# EAGLE schematic AZSMZ (EAGLE 7.2.0)
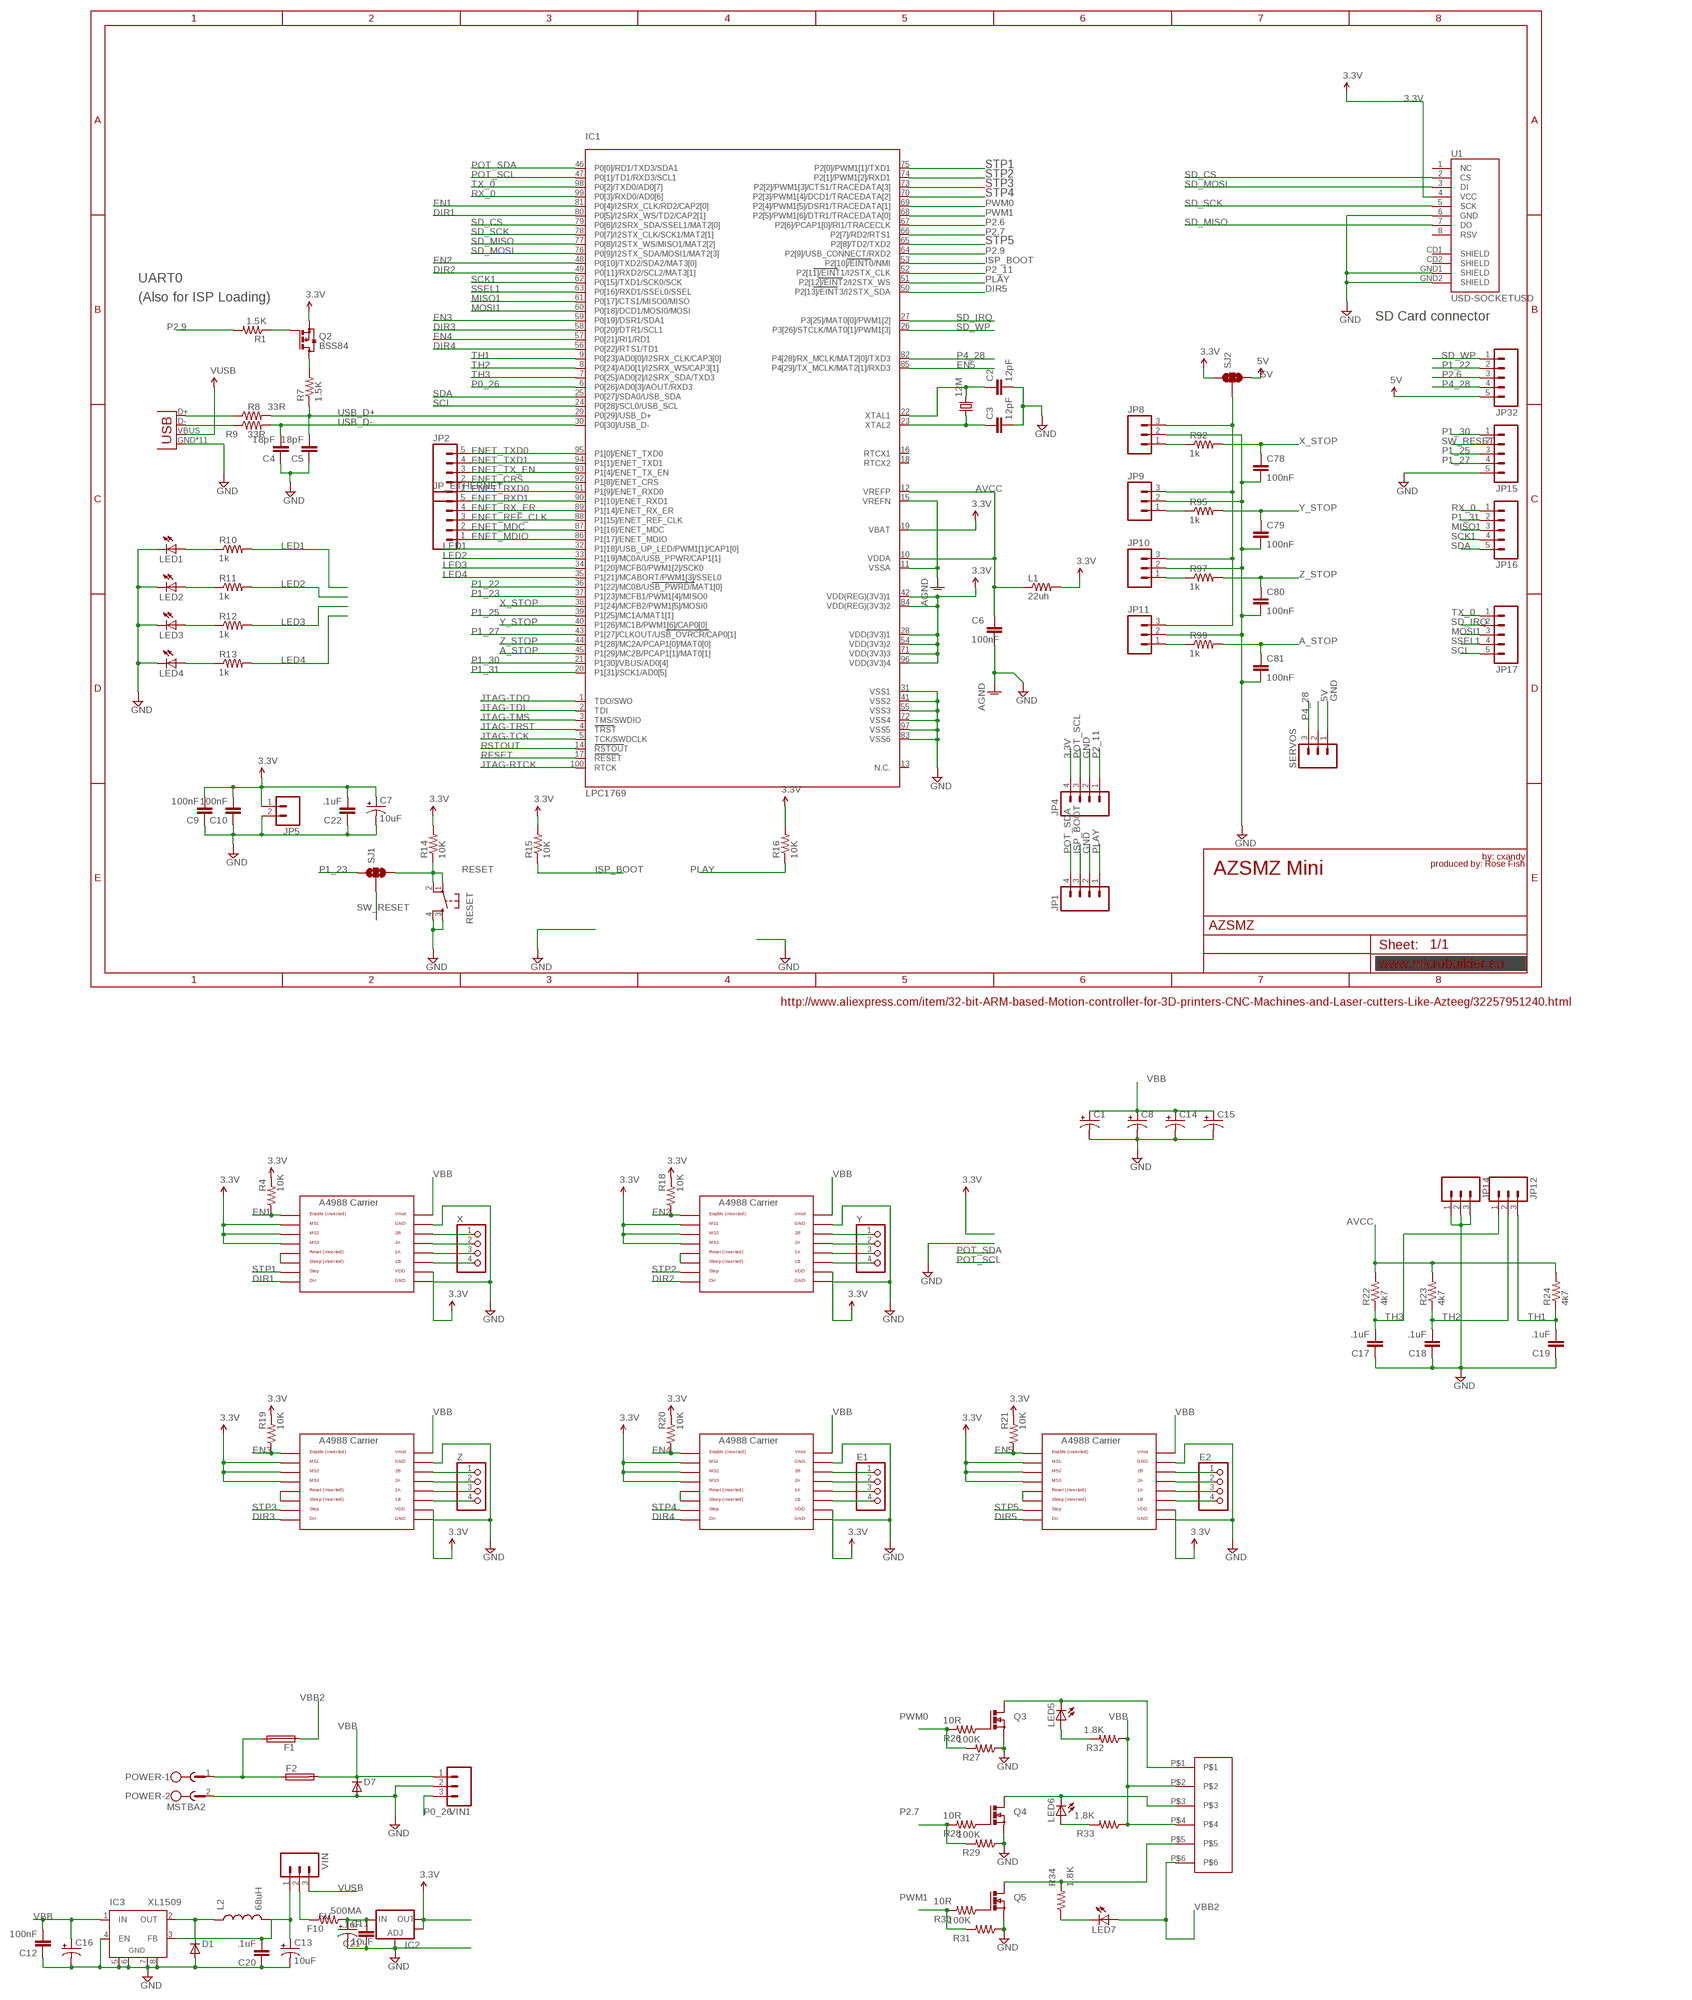
[diagram p0: schematic, sheet 1]

## Parts
12M  CRYSTALHC49S  [HC49/S]
C1  CPOL-US153CLV-0605  [153CLV-0605]
C2  12pF  C-EUC0805K  [C0805K]
C3  12pF  C-EUC0805K  [C0805K]
C4  18pF  C-EUC0805K  [C0805K]
C5  18pF  C-EUC0805  [C0805]
C6  100nF  C-EUC0805K  [C0805K]
C7  10uF  CAP_POL1206  [EIA3216]
C8  CPOL-US153CLV-0605  [153CLV-0605]
C9  100nF  C-EUC0805K  [C0805K]
C10  100nF  C-EUC0805  [C0805]
C11  10uF  CAP_POL1206  [EIA3216]
C12  100nF  C-EUC0805  [C0805]
C13  10uF  CAP_POL1206  [EIA3216]
C14  CPOL-US153CLV-0605  [153CLV-0605]
C15  CPOL-US153CLV-0605  [153CLV-0605]
C16  CPOL-US153CLV-0605  [153CLV-0605]
C17  .1uF  C-EUC0805K  [C0805K]
C18  .1uF  C-EUC0805K  [C0805K]
C19  .1uF  C-EUC0805K  [C0805K]
C20  .1uF  C-EUC0805K  [C0805K]
C21  .1uF  C-EUC0805K  [C0805K]
C22  .1uF  C-EUC0805K  [C0805K]
C78  100nF  C-EUC0805K  [C0805K]
C79  100nF  C-EUC0805K  [C0805K]
C80  100nF  C-EUC0805K  [C0805K]
C81  100nF  C-EUC0805K  [C0805K]
D1  IN4004  CGRM4004-G  [SOD-123_MINI-SMA]
D7  IN4004  CGRM4004-G  [SOD-123_MINI-SMA]
E1  PINHD-1X4  [1X04]
E2  PINHD-1X4  [1X04]
F1  REPRAPJR_PTCFUSE  [REPRAPJR_MFR500]
F2  REPRAPJR_PTCFUSE  [REPRAPJR_MFR500]
F10  500MA  R-US_R1206  [R1206]
IC1  LPC1769  LPC1768  [LQFP100]
IC2  V_REG_LM1117SOT223  [SOT223]
IC3  XL1509  [SO08]
JP1  M04PTHS  [1X04C]
JP2  M051.27MM  [1X05-1.27MM]
JP4  M04PTH  [1X04]
JP5  M021X02-1.27  [1X02-1.27MM]
JP8  M03PTH  [1X03]
JP9  M03PTH  [1X03]
JP10  M03PTH  [1X03]
JP11  M03PTH  [1X03]
JP12  M03PTH  [1X03]
JP14  M03PTH  [1X03]
JP15  M05PTH  [1X05]
JP16  M05PTH  [1X05]
JP17  M05PTH  [1X05]
JP32  M05PTH  [1X05]
JP_ETHERNET  M051.27MM  [1X05-1.27MM]
L1  22uh  R-US_M1206  [M1206]
L2  68uH  INDUCTORCR54  [CR54]
LED1  LEDCHIP-LED0805  [CHIP-LED0805]
LED2  LEDCHIP-LED0805  [CHIP-LED0805]
LED3  LEDCHIP-LED0805  [CHIP-LED0805]
LED4  LEDCHIP-LED0805  [CHIP-LED0805]
LED5  LEDCHIP-LED0805  [CHIP-LED0805]
LED6  LEDCHIP-LED0805  [CHIP-LED0805]
LED7  LEDCHIP-LED0805  [CHIP-LED0805]
POWER  MSTBA2  [MSTBA2]
Q2  BSS84  [SOT23]
Q3  IRF512TO220  [TO220BVS]
Q4  IRF512  [TO220BV]
Q5  IRF512TO220  [TO220BVS]
R1  1.5K  R-US_M0805  [M0805]
R4  10K  R-US_M0805  [M0805]
R7  1.5K  R-US_M0805  [M0805]
R8  33R  R-US_M0805  [M0805]
R9  33R  R-US_M0805  [M0805]
R10  1k  R-US_M0805  [M0805]
R11  1k  R-US_M0805  [M0805]
R12  1k  R-US_M0805  [M0805]
R13  1k  R-US_M0805  [M0805]
R14  10K  R-US_M0805  [M0805]
R15  10K  R-US_M0805  [M0805]
R16  10K  R-US_M0805  [M0805]
R18  10K  R-US_M0805  [M0805]
R19  10K  R-US_M0805  [M0805]
R20  10K  R-US_M0805  [M0805]
R21  10K  R-US_M0805  [M0805]
R22  4k7  R-US_M0805  [M0805]
R23  4k7  R-US_M0805  [M0805]
R24  4k7  R-US_M0805  [M0805]
R26  10R  R-US_M0805  [M0805]
R27  100K  R-US_M0805  [M0805]
R28  10R  R-US_M0805  [M0805]
R29  100K  R-US_M0805  [M0805]
R30  10R  R-US_M0805  [M0805]
R31  100K  R-US_M0805  [M0805]
R32  1.8K  R-US_M0805  [M0805]
R33  1.8K  R-US_M0805  [M0805]
R34  1.8K  R-US_M0805  [M0805]
R92  1k  R-US_M0805  [M0805]
R95  1k  R-US_M0805  [M0805]
R97  1k  R-US_M0805  [M0805]
R99  1k  R-US_M0805  [M0805]
RESET  TAC_SWITCHSMD  [TACTILE_SWITCH_SMD]
SERVOS  M03PTH  [1X03]
SJ1  SOLDERJUMPER_2WAYS  [SJ_3]
SJ2  SOLDERJUMPER_2WAYS  [SJ_3]
U1  USD-SOCKETUSD  [USD-SOCKET-PP]
U$3  282837-6  [282837-6]
U$11  A4988BREAKOUT  [A4988BREAKOUT]
U$12  A4988BREAKOUT  [A4988BREAKOUT]
U$13  A4988BREAKOUT  [A4988BREAKOUT]
U$14  A4988BREAKOUT  [A4988BREAKOUT]
U$15  A4988BREAKOUT  [A4988BREAKOUT]
VIN  M03PTH  [1X03]
VIN1  M03PTH  [1X03]
X  PINHD-1X4  [1X04]
X1  USB-MICROB  [USB-MICROB]
Y  PINHD-1X4  [1X04]
Z  PINHD-1X4  [1X04]

## Nets
3.3V: C7.A(+) C9.2 C10.2 C22.2 IC1.19(VBAT) IC1.28(VDD(3V3)1) IC1.42(VDD(REG)(3V3)1) IC1.54(VDD(3V3)2) IC1.71(VDD(3V3)3) IC1.84(VDD(REG)(3V3)2) IC1.96(VDD(3V3)4) IC2.2(OUT) IC2.4(OUT) JP4.4 JP5.1 L1.2 Q2.2(S) R4.2 R14.2 R15.2 R16.2 R18.2 R19.2 R20.2 R21.2 SJ2.1 U1.4(VCC) U$11.MS1 U$11.MS2 U$11.MS3 U$11.VDD U$12.MS1 U$12.MS2 U$12.MS3 U$12.VDD U$13.MS1 U$13.MS2 U$13.MS3 U$13.VDD U$14.MS1 U$14.MS2 U$14.MS3 U$14.VDD U$15.MS1 U$15.MS2 U$15.MS3 U$15.VDD
5V: C11.A(+) C21.2 F10.1 IC2.3(IN) JP32.5 SERVOS.2 SJ2.3
A_STOP: C81.1 IC1.45(P1[29]/MC2B/PCAP1[1]/MAT0[1]) R99.2
AGND: C6.2 IC1.11(VSSA) IC1.15(VREFN) ; supply symbol labelled GND
AVCC: C6.1 IC1.10(VDDA) IC1.12(VREFP) L1.1 R22.2 R23.2 R24.2
DIR1: IC1.80(P0[5]/I2SRX_WS/TD2/CAP2[1]) U$11.DIR
DIR2: IC1.49(P0[11]/RXD2/SCL2/MAT3[1]) U$12.DIR
DIR3: IC1.58(P0[20]/DTR1/SCL1) U$13.DIR
DIR4: IC1.56(P0[22]/RTS1/TD1) U$14.DIR
DIR5: IC1.50(P2[13]/EINT3/I2STX_SDA) U$15.DIR
EN1: IC1.81(P0[4]/I2SRX_CLK/RD2/CAP2[0]) R4.1 U$11.EN
EN2: IC1.48(P0[10]/TXD2/SDA2/MAT3[0]) R18.1 U$12.EN
EN3: IC1.59(P0[19]/DSR1/SDA1) R19.1 U$13.EN
EN4: IC1.57(P0[21]/RI1/RD1) R20.1 U$14.EN
EN5: IC1.85(P4[29]/TX_MCLK/MAT2[1]/RXD3) R21.1 U$15.EN
ENET_CRS: IC1.92(P1[8]/ENET_CRS) JP2.2
ENET_MDC: IC1.87(P1[16]/ENET_MDC) JP_ETHERNET.2
ENET_MDIO: IC1.86(P1[17]/ENET_MDIO) JP_ETHERNET.1
ENET_REF_CLK: IC1.88(P1[15]/ENET_REF_CLK) JP_ETHERNET.3
ENET_RX_ER: IC1.89(P1[14]/ENET_RX_ER) JP_ETHERNET.4
ENET_RXD0: IC1.91(P1[9]/ENET_RXD0) JP2.1
ENET_RXD1: IC1.90(P1[10]/ENET_RXD1) JP_ETHERNET.5
ENET_TX_EN: IC1.93(P1[4]/ENET_TX_EN) JP2.3
ENET_TXD0: IC1.95(P1[0]/ENET_TXD0) JP2.5
ENET_TXD1: IC1.94(P1[1]/ENET_TXD1) JP2.4
GND: C1.- C2.2 C3.2 C4.1 C5.1 C7.C(-) C8.- C9.1 C10.1 C11.C(-) C12.1 C13.C(-) C14.- C15.- C16.- C17.1 C18.1 C19.1 C20.1 C21.1 C22.1 C78.2 C79.2 C80.2 C81.2 D1.A D7.A IC1.31(VSS1) IC1.41(VSS2) IC1.55(VSS3) IC1.72(VSS4) IC1.83(VSS6) IC1.97(VSS5) IC2.1(ADJ) IC3.4(EN) IC3.5(GND) IC3.6(GND1) IC3.7(GND2) IC3.8(GND) JP1.2 JP4.2 JP5.2 JP8.2 JP9.2 JP10.2 JP11.2 JP14.1 JP14.2 JP14.3 JP15.5 LED1.C LED2.C LED3.C LED4.C POWER.2 Q3.S Q4.S Q5.S R27.1 R29.1 R31.1 RESET.3 RESET.4 SERVOS.1 U1.6(GND) U1.GND1(SHIELD) U1.GND2(SHIELD) U$11.GND U$11.GND@0(GND) U$12.GND U$12.GND@0(GND) U$13.GND U$13.GND@0(GND) U$14.GND U$14.GND@0(GND) U$15.GND U$15.GND@0(GND) VIN1.2 X1.GND X1.MT1(GND) X1.MT2(GND) X1.MT3(GND) X1.MT4(GND) X1.P$1(GND) X1.P$2(GND) X1.P$3(GND) X1.P$4(GND) X1.P$5(GND) X1.P$6(GND)
ISP_BOOT: IC1.53(P2[10]/EINT0/NMI) JP1.3 R15.1
JTAG-RTCK: IC1.100(RTCK)
JTAG-TCK: IC1.5(TCK/SWDCLK)
JTAG-TDI: IC1.2(TDI)
JTAG-TDO: IC1.1(TDO/SWO)
JTAG-TMS: IC1.3(TMS/SWDIO)
JTAG-TRST: IC1.4(TRST)
LED1: IC1.32(P1[18]/USB_UP_LED/PWM1[1]/CAP1[0]) R10.2
LED2: IC1.33(P1[19]/MC0A/USB_PPWR/CAP1[1]) R11.2
LED3: IC1.34(P1[20]/MCFB0/PWM1[2]/SCK0) R12.2
LED4: IC1.35(P1[21]/MCABORT/PWM1[3]/SSEL0) R13.2
MISO1: IC1.61(P0[17]/CTS1/MISO0/MISO) JP16.3
MOSI1: IC1.60(P0[18]/DCD1/MOSI0/MOSI) JP17.3
N$1: 12M.2 C2.1 IC1.22(XTAL1)
N$2: 12M.1 C3.1 IC1.23(XTAL2)
N$3: U$11.2B X.1
N$4: U$12.RST U$12.SLP(SLEEP)
N$5: Q2.1(G) R1.1
N$6: U$11.2A X.2
N$7: U$11.1A X.3
N$8: U$12.2B Y.1
N$9: U$11.RST U$11.SLP(SLEEP)
N$10: U$12.2A Y.2
N$11: U$12.1A Y.3
N$12: U$12.1B Y.4
N$13: U$11.1B X.4
N$14: U$13.RST U$13.SLP(SLEEP)
N$15: U$13.2B Z.1
N$16: Q5.D Q5.D1(D) R34.2 U$3.P$5
N$17: U$13.2A Z.2
N$18: LED7.C R34.1
N$19: F1.2 F2.1 F2.3 F2.4 POWER.1
N$20: U$13.1A Z.3
N$21: U$13.1B Z.4
N$22: U$14.RST U$14.SLP(SLEEP)
N$24: E1.1 U$14.2B
N$25: E1.2 U$14.2A
N$26: E1.3 U$14.1A
N$27: E1.4 U$14.1B
N$28: U$15.RST U$15.SLP(SLEEP)
N$29: E2.1 U$15.2B
N$30: E2.2 U$15.2A
N$31: E2.3 U$15.1A
N$32: E2.4 U$15.1B
N$35: Q3.G R26.1
N$36: Q4.G R28.1
N$37: Q5.G R30.1
N$40: F10.2 VIN.2
N$41: D1.C IC3.2(OUT) L2.P$1
N$43: C13.A(+) C20.2 IC3.3(FB) L2.P$2 VIN.1
N$44: LED5.C Q3.D Q3.D1(D) U$3.P$1
N$45: LED6.C Q4.D U$3.P$3
N$48: LED6.A R33.2
N$49: LED5.A R32.2
N$51: Q2.3(D) R7.2
N$61: R8.1 X1.D+
N$62: R9.1 X1.D-
N$84: LED4.A R13.1
N$85: LED3.A R12.1
N$86: LED2.A R11.1
N$87: LED1.A R10.1
N$114: JP9.1 R95.1
N$115: JP8.3 JP9.3 JP10.3 JP11.3 SJ2.2
N$116: JP10.1 R97.1
N$117: JP11.1 R99.1
N$122: JP8.1 R92.1
P0_26: IC1.6(P0[26]/AD0[3]/AOUT/RXD3) VIN1.3
P1_22: IC1.36(P1[22]/MC0B/USB_PWRD/MAT1[0]) JP32.2
P1_23: IC1.37(P1[23]/MCFB1/PWM1[4]/MISO0) SJ1.1
P1_25: IC1.39(P1[25]/MC1A/MAT1[1]) JP15.3
P1_27: IC1.43(P1[27]/CLKOUT/USB_OVRCR/CAP0[1]) JP15.4
P1_30: IC1.21(P1[30]/VBUS/AD0[4]) JP15.1
P1_31: IC1.20(P1[31]/SCK1/AD0[5]) JP16.2
P2.6: IC1.67(P2[6]/PCAP1[0]/RI1/TRACECLK) JP32.3
P2.7: IC1.66(P2[7]/RD2/RTS1) R28.2 R29.2
P2.9: IC1.64(P2[9]/USB_CONNECT/RXD2) R1.2
P2_11: IC1.52(P2[11]/EINT1/I2STX_CLK) JP4.1
P4_28: IC1.82(P4[28]/RX_MCLK/MAT2[0]/TXD3) JP32.4 SERVOS.3
PLAY: IC1.51(P2[12]/EINT2/I2STX_WS) JP1.1 R16.1
POT_SCL: IC1.47(P0[1]/TD1/RXD3/SCL1) JP4.3
POT_SDA: IC1.46(P0[0]/RD1/TXD3/SDA1) JP1.4
PWM0: IC1.69(P2[4]/PWM1[5]/DSR1/TRACEDATA[1]) R26.2 R27.2
PWM1: IC1.68(P2[5]/PWM1[6]/DTR1/TRACEDATA[0]) R30.2 R31.2
RESET: IC1.17(RESET) R14.1 RESET.1 RESET.2 SJ1.3
RSTOUT: IC1.14(RSTOUT)
RX_0: IC1.99(P0[3]/RXD0/AD0[6]) JP16.1
SCK1: IC1.62(P0[15]/TXD1/SCK0/SCK) JP16.4
SCL: IC1.24(P0[28]/SCL0/USB_SCL) JP17.5
SD_CS: IC1.79(P0[6]/I2SRX_SDA/SSEL1/MAT2[0]) U1.2(CS)
SD_IRQ: IC1.27(P3[25]/MAT0[0]/PWM1[2]) JP17.2
SD_MISO: IC1.77(P0[8]/I2STX_WS/MISO1/MAT2[2]) U1.7(DO)
SD_MOSI: IC1.76(P0[9]/I2STX_SDA/MOSI1/MAT2[3]) U1.3(DI)
SD_SCK: IC1.78(P0[7]/I2STX_CLK/SCK1/MAT2[1]) U1.5(SCK)
SD_WP: IC1.26(P3[26]/STCLK/MAT0[1]/PWM1[3]) JP32.1
SDA: IC1.25(P0[27]/SDA0/USB_SDA) JP16.5
SSEL1: IC1.63(P0[16]/RXD1/SSEL0/SSEL) JP17.4
STP1: IC1.75(P2[0]/PWM1[1]/TXD1) U$11.STEP
STP2: IC1.74(P2[1]/PWM1[2]/RXD1) U$12.STEP
STP3: IC1.73(P2[2]/PWM1[3]/CTS1/TRACEDATA[3]) U$13.STEP
STP4: IC1.70(P2[3]/PWM1[4]/DCD1/TRACEDATA[2]) U$14.STEP
STP5: IC1.65(P2[8]/TD2/TXD2) U$15.STEP
SW_RESET: JP15.2 SJ1.2
TH1: C19.2 IC1.9(P0[23]/AD0[0]/I2SRX_CLK/CAP3[0]) JP12.3 R24.1
TH2: C18.2 IC1.8(P0[24]/AD0[1]/I2SRX_WS/CAP3[1]) JP12.2 R23.1
TH3: C17.2 IC1.7(P0[25]/AD0[2]/I2SRX_SDA/TXD3) JP12.1 R22.1
TX_0: IC1.98(P0[2]/TXD0/AD0[7]) JP17.1
USB_D+: C5.2 IC1.29(P0[29]/USB_D+) R7.1 R8.2
USB_D-: C4.2 IC1.30(P0[30]/USB_D-) R9.2
VBB: C1.+ C8.+ C12.2 C14.+ C15.+ C16.+ D7.C F2.2 IC3.1(IN) R32.1 R33.1 U$3.P$2 U$3.P$4 U$11.VMOT U$12.VMOT U$13.VMOT U$14.VMOT U$15.VMOT VIN1.1
VBB2: F1.1 F1.3 F1.4 LED7.A U$3.P$6
VUSB: VIN.3 X1.VBUS
X_STOP: C78.1 IC1.38(P1[24]/MCFB2/PWM1[5]/MOSI0) R92.2
Y_STOP: C79.1 IC1.40(P1[26]/MC1B/PWM1[6]/CAP0[0]) R95.2
Z_STOP: C80.1 IC1.44(P1[28]/MC2A/PCAP1[0]/MAT0[0]) R97.2
Unconnected: IC1.13(N.C.) IC1.16(RTCX1) IC1.18(RTCX2) U1.1(NC) U1.8(RSV) U1.CD1(SHIELD) U1.CD2(SHIELD)

## Notes on the sheet
- UART0
- (Also for ISP Loading)
- SD Card connector
- by: cxandy
- produced by: Rose Fish
- AZSMZ Mini
- http://www.aliexpress.com/item/32-bit-ARM-based-Motion-controller-for-3D-printers-CNC-Machines-and-Laser-cutters-Like-Azteeg/32257951240.html

## Library data of the parts
12M = crystal:CRYSTAL: CRYSTAL; OC_FARNELL: 1667008; OC_NEWARK: unknown
C1 C8 C14-C16 = adafruit:CPOL-US: POLARIZED CAPACITOR, American symbol
C2-C6 C9 C10 C12 C17-C22 C78-C81 = rcl:C-EU: CAPACITOR, European symbol
C7 C11 C13 = SparkFun:CAP_POL: Capacitor Polarized These are standard SMD and PTH capacitors. Normally 10uF, 47uF, and 100uF in electrolytic and tantalum varieties. Always verify the external diameter of the through hole cap, it varies with capacity, voltage, and manufacturer. The EIA devices should be standard.
D1 D7 = diode:CGRM400*-G: Molded plasitc,JEDEC SOD-123/Mini SMA Source: Comchip CGRM4001-G.pdf
E1 E2 X Y Z = pinhead:PINHD-1X4: PIN HEADER
F1 F2 = RAMPS_1-41:REPRAPJR_PTCFUSE: LITTLEFUSE Picofuse/slow Littlefuse
F10 L1 R1 R4 R7-R16 R18-R24 R26-R34 R92 R95 R97 R99 = resistor:R-US_: RESISTOR, American symbol
IC1 = microbuilder:LPC1768: LPC1768 100 MHz 32-bit ARM Cortex-M3 based microcontroller featuring a high level of integration and low power consumption. 512 kB Flash, 64 kB SRAM, USB Device/Host/OTG, Ethernet, CAN, I2S, 10-bit DAC Digikey: 568-4796-ND
IC2 = SparkFun:V_REG_LM1117: Voltage Regulator LM1117 Standard adjustable voltage regulator but in SMD form. Spark Fun Electronics SKU : COM-00595
IC3 = LM2594:XL1509
JP1 JP4 = SparkFun:M04: Header 4 Standard 4-pin 0.1" header. Use with straight break away headers (SKU : PRT-00116), right angle break away headers (PRT-00553), swiss pins (PRT-00743), machine pins (PRT-00117), and female headers (PRT-00115). Molex polarized connector foot print use with SKU : PRT-08231 with associated crimp pins and housings. 1MM SMD Version SKU: PRT-10208
JP2 JP15-JP17 JP32 JP_ETHERNET = SparkFun:M05: Header 5 Standard 5-pin 0.1" header. Use with straight break away headers (SKU : PRT-00116), right angle break away headers (PRT-00553), swiss pins (PRT-00743), machine pins (PRT-00117), and female headers (PRT-00115). Molex polarized connector foot print use with SKU : PRT-08230 with associated crimp pins and housings.
JP5 = SparkFun:M02: Header 2 Standard 2-pin 0.1" header. Use with straight break away headers (SKU : PRT-00116), right angle break away headers (PRT-00553), swiss pins (PRT-00743), machine pins (PRT-00117), and female headers (PRT-00115). Molex polarized connector foot print use with SKU : PRT-08233 with associated crimp pins and housings.
JP8-JP12 JP14 SERVOS VIN VIN1 = SparkFun:M03: Header 3 Standard 3-pin 0.1" header. Use with straight break away headers (SKU : PRT-00116), right angle break away headers (PRT-00553), swiss pins (PRT-00743), machine pins (PRT-00117), and female headers (PRT-00115). Molex polarized connector foot print use with SKU : PRT-08232 with associated crimp pins and housings.
L2 = SparkFun:INDUCTOR: Inductors Basic Inductor/Choke - 0603 and 1206. Footprints are not proven and vary greatly between part numbers.
LED1-LED7 = led:LED: LED OSRAM: - CHIPLED LG R971, LG N971, LY N971, LG Q971, LY Q971, LO R971, LY R971 LH N974, LH R974 LS Q976, LO Q976, LY Q976 LO Q996 - Hyper CHIPLED LW Q18S LB Q993, LB Q99A, LB R99A - SideLED LS A670, LO A670, LY A670, LG A670, LP A670 LB A673, LV A673, LT A673, LW A673 LH A674 LY A675 LS A676, LA A676, LO A676, LY A676, LW A676 LS A679, LY A679, LG A679 - Hyper Micro SIDELED® LS Y876, LA Y876, LO Y876, LY Y876 LT Y87S - SmartLED LW L88C, LW L88S LB L89C, LB L89S, LG L890 LS L89K, LO L89K, LY L89K LS L896, LA L896, LO L896, LY L896 - TOPLED LS T670, LO T670, LY T670, LG T670, LP T670 LSG T670, LSP T670, LSY T670, LOP T670, LYG T670 LG T671, LOG T671, LSG T671 LB T673, LV T673, LT T673, LW T673 LH T674 LS T676, LA T676, LO T676, LY T676, LB T676, LH T676, LSB T676, LW T676 LB T67C, LV T67C, LT T67C, LS T67K, LO T67K, LY T67K, LW E67C LS E67B, LA E67B, LO E67B, LY E67B, LB E67C, LV E67C, LT E67C LW T67C LS T679, LY T679, LG T679 LS T770, LO T770, LY T770, LG T770, LP T770 LB T773, LV T773, LT T773, LW T773 LH T774 LS E675, LA E675, LY E675, LS T675 LS T776, LA T776, LO T776, LY T776, LB T776 LHGB T686 LT T68C, LB T68C - Hyper Mini TOPLED® LB M676 - Mini TOPLED Santana® LG M470 LS M47K, LO M47K, LY M47K Source: http://www.osram.convergy.de LUXEON: - LUMILED® LXK2-PW12-R00, LXK2-PW12-S00, LXK2-PW14-U00, LXK2-PW14-V00 LXK2-PM12-R00, LXK2-PM12-S00, LXK2-PM14-U00 LXK2-PE12-Q00, LXK2-PE12-R00, LXK2-PE12-S00, LXK2-PE14-T00, LXK2-PE14-U00 LXK2-PB12-K00, LXK2-PB12-L00, LXK2-PB12-M00, LXK2-PB14-N00, LXK2-PB14-P00, LXK2-PB14-Q00 LXK2-PR12-L00, LXK2-PR12-M00, LXK2-PR14-Q00, LXK2-PR14-R00 LXK2-PD12-Q00, LXK2-PD12-R00, LXK2-PD12-S00 LXK2-PH12-R00, LXK2-PH12-S00 LXK2-PL12-P00, LXK2-PL12-Q00, LXK2-PL12-R00 Source: www.luxeon.com KINGBRIGHT: KA-3528ASYC Source: www.kingbright.com
POWER = con-phoenix-508:MSTBA2: PHOENIX; MF: FARNELL; MPN: 1757242; OC_FARNELL: 3705171; OC_NEWARK: 71C4161
Q2 = transistor-small-signal:BSS84: P-CHANNEL MOS FET
Q3-Q5 = transistor-power:IRF512: N-CHANNEL MOS FET
RESET = SparkFun:TAC_SWITCH: Momentary Switch Button commonly used for reset or general input. Spark Fun Electronics SKU : COM-00097
SJ1 SJ2 = SparkFun:SOLDERJUMPER_2WAY: Solder Jumper 2 way solder jumper
U1 = SparkFun:USD-SOCKET: microSD Socket Push-push type uSD socket. Schematic element and footprint production proven. Spark Fun Electronics SKU : PRT-00127. tDoc lines correctly indicate media card edge positions when inserting (unlocked, locked, depressed).
U$3 = RepRapjr:282837-6
U$11-U$15 = RepRapjr:A4988BREAKOUT
X1 = SparkFun:USB: USB Connectors USB-B-PTH is fully proven SKU : PRT-00139 USB-miniB is fully proven SKU : PRT-00587 USB-A-PCB is untested. USB-A-H is throughly reviewed, but untested. Spark Fun Electronics SKU : PRT-00437 USB-B-SMT is throughly reviewed, but untested. Needs silkscreen touching up. USB-A-S has not been used/tested USB-MB-H has not been used/tested